# Altium schematic sheet PortSplitters.SchDoc
size A; Organization: Altium Limited; Address1: L3, 12a Rodborough Rd; Address2: Frenchs Forest; Address3: NSW; Address4: Australia 2086; DocumentNumber: 4; SheetNumber: 4; SheetTotal: 8
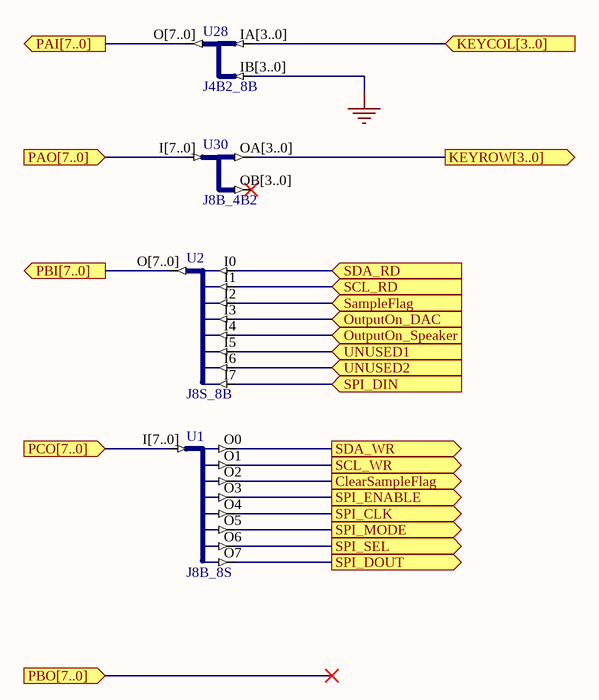
[diagram p0: PortSplitters.SchDoc]

## Parts
U1  J8B_8S
U2  J8S_8B
U28  J4B2_8B
U30  J8B_4B2

## Ports
ClearSampleFlag (out), KEYCOL[3..0] (in), KEYROW[3..0] (out), OutputOn_DAC (in), OutputOn_Speaker (in), PAI[7..0] (out), PAO[7..0] (in), PBI[7..0] (out), PBO[7..0] (in), PCO[7..0] (in), SampleFlag (in), SCL_RD (in), SCL_WR (out), SDA_RD (in), SDA_WR (out), SPI_CLK (out), SPI_DIN (in), SPI_DOUT (out), SPI_ENABLE (out), SPI_MODE (out), SPI_SEL (out), UNUSED1 (in), UNUSED2 (in)

## Nets
GNDBUS[..]: U28.IB[3..0]
ClearSampleFlag: U1.O2 ; port ClearSampleFlag
KEYCOL[3..0]: U28.IA[3..0] ; port KEYCOL[3..0]
KEYROW[3..0]: U30.OA[3..0] ; port KEYROW[3..0]
OutputOn_DAC: U2.I3 ; port OutputOn_DAC
OutputOn_Speaker: U2.I4 ; port OutputOn_Speaker
PAI[7..0]: U28.O[7..0] ; port PAI[7..0]
PAO[7..0]: U30.I[7..0] ; port PAO[7..0]
PBI[7..0]: U2.O[7..0] ; port PBI[7..0]
PCO[7..0]: U1.I[7..0] ; port PCO[7..0]
SampleFlag: U2.I2 ; port SampleFlag
SCL_RD: U2.I1 ; port SCL_RD
SCL_WR: U1.O1 ; port SCL_WR
SDA_RD: U2.I0 ; port SDA_RD
SDA_WR: U1.O0 ; port SDA_WR
SPI_CLK: U1.O4 ; port SPI_CLK
SPI_DIN: U2.I7 ; port SPI_DIN
SPI_DOUT: U1.O7 ; port SPI_DOUT
SPI_ENABLE: U1.O3 ; port SPI_ENABLE
SPI_MODE: U1.O5 ; port SPI_MODE
SPI_SEL: U1.O6 ; port SPI_SEL
UNUSED1: U2.I5 ; port UNUSED1
UNUSED2: U2.I6 ; port UNUSED2

Not connected (* = marked no-connect by the designer): U30 OB[3..0]*

## Notes on the sheet
- Title
- Size:
- Date:
- A
- Number:
- Time:
- Revision:
- Sheet
- of
- File:

## Library data of the parts
U1 = J8B_8S: 8-Bit input bus to 8 single pin outputs; ArchiveName: GENERIC; Published: 18-Nov-2003; Publisher: Altium Limited; Core Revision: 1.00.00
U2 = J8S_8B: 8 Single pin inputs to single 8-Bit output bus; ArchiveName: GENERIC; Published: 18-Nov-2003; Publisher: Altium Limited; Core Revision: 1.00.00
U28 = J4B2_8B: 2 x 4-Bit input bus to 1 x 8-bit output bus; ArchiveName: GENERIC; Published: 18-Nov-2003; Publisher: Altium Limited; Core Revision: 1.00.00
U30 = J8B_4B2: 1 x 8-bit input bus to 2 x 4-Bit output bus; ArchiveName: GENERIC; Published: 18-Nov-2003; Publisher: Altium Limited; Core Revision: 1.00.00